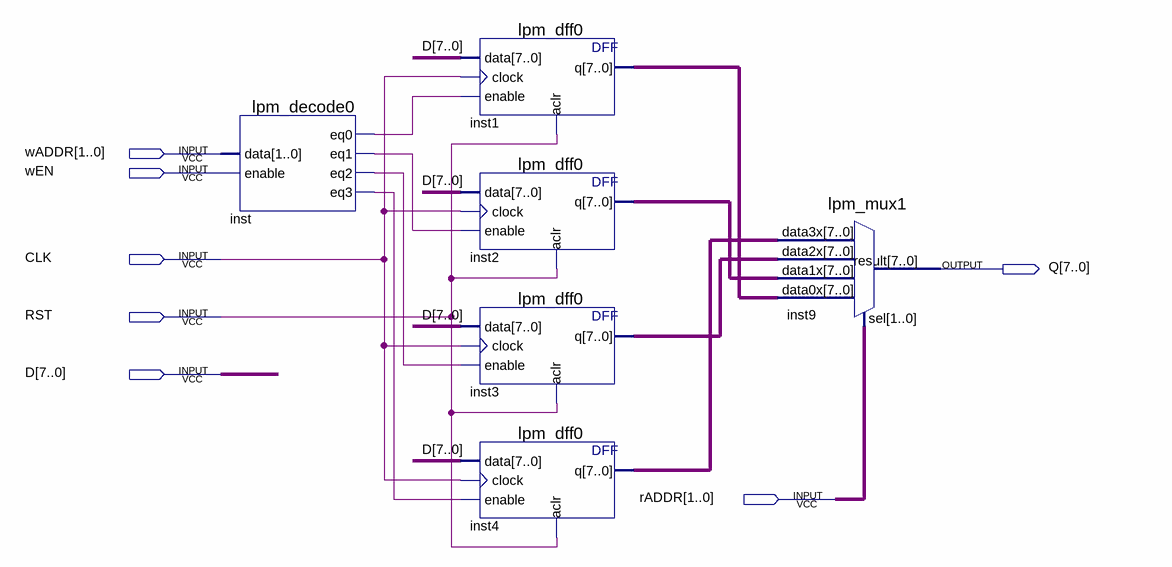
[diagram p0: schematic sheet]
// Quartus schematic register.bdf as structural Verilog: 6 symbols, 7 pins
module register (
  input  [1:0] wADDR,
  input  wEN,
  input  CLK,
  input  RST,
  input  [7:0] D,
  input  [1:0] rADDR,
  output [7:0] Q
);

  wire inst_eq0, inst_eq1, inst_eq2, inst_eq3;
  wire [7:0] inst1_q, inst2_q, inst3_q, inst4_q;

  lpm_decode0 inst (.data(wADDR), .enable(wEN), .eq0(inst_eq0), .eq1(inst_eq1), .eq2(inst_eq2), .eq3(inst_eq3));
  lpm_dff0 inst1 (.data(D), .clock(CLK), .enable(inst_eq0), .aclr(RST), .q(inst1_q));
  lpm_dff0 inst2 (.data(D), .clock(CLK), .enable(inst_eq1), .aclr(RST), .q(inst2_q));
  lpm_dff0 inst3 (.data(D), .clock(CLK), .enable(inst_eq2), .aclr(RST), .q(inst3_q));
  lpm_dff0 inst4 (.data(D), .clock(CLK), .enable(inst_eq3), .aclr(RST), .q(inst4_q));
  lpm_mux1 inst9 (.data3x(inst4_q), .data2x(inst3_q), .data1x(inst2_q), .data0x(inst1_q), .sel(rADDR), .result(Q));
endmodule
